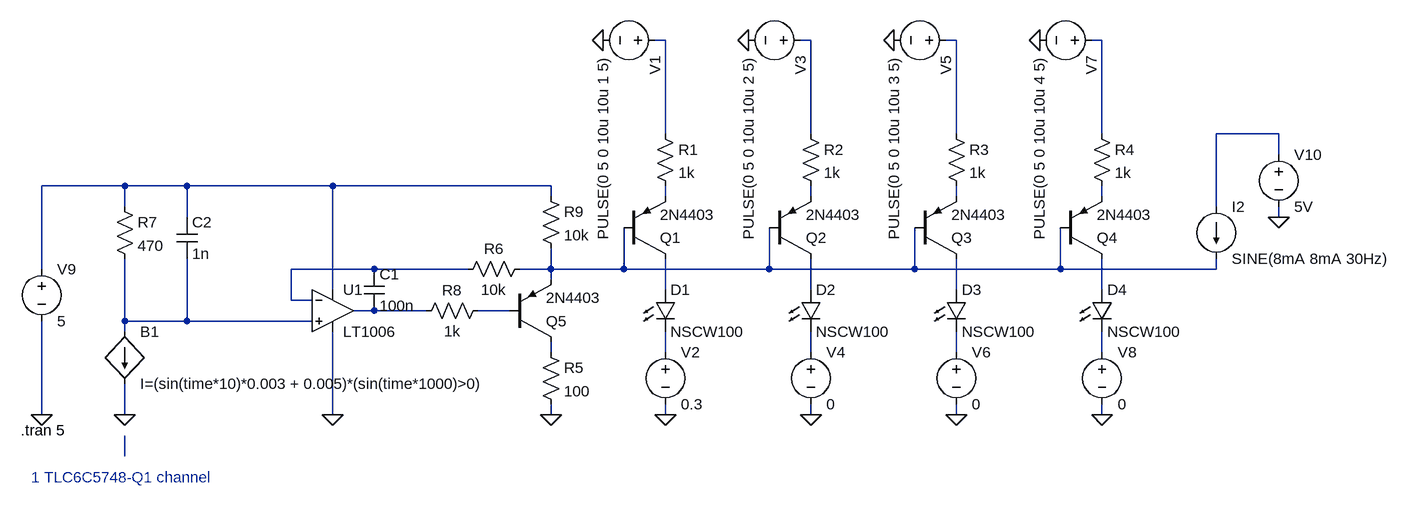
[diagram p0: schematic led-drive.asc]
led-drive.asc, the LTspice schematic file:
Version 4
SHEET 1 1884 680
WIRE 96 -496 80 -496
WIRE 320 -496 304 -496
WIRE 544 -496 528 -496
WIRE 768 -496 752 -496
WIRE 96 -352 96 -496
WIRE 320 -352 320 -496
WIRE 544 -352 544 -496
WIRE 768 -352 768 -496
WIRE 1040 -352 944 -352
WIRE 1040 -320 1040 -352
WIRE -736 -272 -864 -272
WIRE -640 -272 -736 -272
WIRE -416 -272 -640 -272
WIRE -80 -272 -416 -272
WIRE -80 -256 -80 -272
WIRE 96 -256 96 -272
WIRE 320 -256 320 -272
WIRE 544 -256 544 -272
WIRE 768 -256 768 -272
WIRE -736 -240 -736 -272
WIRE 944 -240 944 -352
WIRE -640 -224 -640 -272
WIRE 1040 -224 1040 -240
WIRE -864 -144 -864 -272
WIRE -352 -144 -480 -144
WIRE -208 -144 -352 -144
WIRE -80 -144 -80 -176
WIRE -80 -144 -128 -144
WIRE 32 -144 32 -208
WIRE 32 -144 -80 -144
WIRE 256 -144 256 -208
WIRE 256 -144 32 -144
WIRE 480 -144 480 -208
WIRE 480 -144 256 -144
WIRE 704 -144 704 -208
WIRE 704 -144 480 -144
WIRE 944 -144 944 -160
WIRE 944 -144 704 -144
WIRE -80 -128 -80 -144
WIRE -416 -112 -416 -272
WIRE 96 -112 96 -160
WIRE 320 -112 320 -160
WIRE 544 -112 544 -160
WIRE 768 -112 768 -160
WIRE -480 -96 -480 -144
WIRE -448 -96 -480 -96
WIRE -352 -80 -384 -80
WIRE -272 -80 -352 -80
WIRE -144 -80 -192 -80
WIRE -736 -64 -736 -160
WIRE -640 -64 -640 -160
WIRE -640 -64 -736 -64
WIRE -448 -64 -640 -64
WIRE -736 -48 -736 -64
WIRE -80 -16 -80 -32
WIRE 96 -16 96 -48
WIRE 320 -16 320 -48
WIRE 544 -16 544 -48
WIRE 768 -16 768 -48
WIRE -864 80 -864 -64
WIRE -736 80 -736 32
WIRE -416 80 -416 -48
WIRE -80 80 -80 64
WIRE 96 80 96 64
WIRE 320 80 320 64
WIRE 544 80 544 64
WIRE 768 80 768 64
WIRE -736 144 -736 112
FLAG 96 80 0
FLAG 0 -496 0
FLAG 320 80 0
FLAG 224 -496 0
FLAG 544 80 0
FLAG 448 -496 0
FLAG 768 80 0
FLAG 672 -496 0
FLAG -736 80 0
FLAG -864 80 0
FLAG 1040 -224 0
FLAG -416 80 0
FLAG -80 80 0
SYMBOL LED 80 -112 R0
SYMATTR InstName D1
SYMATTR Value NSCW100
SYMATTR Description Diode
SYMATTR Type diode
SYMBOL voltage 96 -496 R90
WINDOW 123 0 0 Left 2
WINDOW 39 0 0 Left 2
SYMATTR InstName V1
SYMATTR Value PULSE(0 5 0 10u 10u 1 5)
SYMBOL res 80 -368 R0
SYMATTR InstName R1
SYMATTR Value 1k
SYMBOL pnp 32 -160 M180
SYMATTR InstName Q1
SYMATTR Value 2N4403
SYMBOL voltage 96 -32 R0
WINDOW 123 0 0 Left 2
WINDOW 39 0 0 Left 2
SYMATTR InstName V2
SYMATTR Value 0.3
SYMBOL LED 304 -112 R0
SYMATTR InstName D2
SYMATTR Value NSCW100
SYMATTR Description Diode
SYMATTR Type diode
SYMBOL voltage 320 -496 R90
WINDOW 123 0 0 Left 2
WINDOW 39 0 0 Left 2
SYMATTR InstName V3
SYMATTR Value PULSE(0 5 0 10u 10u 2 5)
SYMBOL res 304 -368 R0
SYMATTR InstName R2
SYMATTR Value 1k
SYMBOL pnp 256 -160 M180
SYMATTR InstName Q2
SYMATTR Value 2N4403
SYMBOL voltage 320 -32 R0
WINDOW 123 0 0 Left 2
WINDOW 39 0 0 Left 2
SYMATTR InstName V4
SYMATTR Value 0
SYMBOL LED 528 -112 R0
SYMATTR InstName D3
SYMATTR Value NSCW100
SYMATTR Description Diode
SYMATTR Type diode
SYMBOL voltage 544 -496 R90
WINDOW 123 0 0 Left 2
WINDOW 39 0 0 Left 2
SYMATTR InstName V5
SYMATTR Value PULSE(0 5 0 10u 10u 3 5)
SYMBOL res 528 -368 R0
SYMATTR InstName R3
SYMATTR Value 1k
SYMBOL pnp 480 -160 M180
SYMATTR InstName Q3
SYMATTR Value 2N4403
SYMBOL voltage 544 -32 R0
WINDOW 123 0 0 Left 2
WINDOW 39 0 0 Left 2
SYMATTR InstName V6
SYMATTR Value 0
SYMBOL LED 752 -112 R0
SYMATTR InstName D4
SYMATTR Value NSCW100
SYMATTR Description Diode
SYMATTR Type diode
SYMBOL voltage 768 -496 R90
WINDOW 123 0 0 Left 2
WINDOW 39 0 0 Left 2
SYMATTR InstName V7
SYMATTR Value PULSE(0 5 0 10u 10u 4 5)
SYMBOL res 752 -368 R0
SYMATTR InstName R4
SYMATTR Value 1k
SYMBOL pnp 704 -160 M180
SYMATTR InstName Q4
SYMATTR Value 2N4403
SYMBOL voltage 768 -32 R0
WINDOW 123 0 0 Left 2
WINDOW 39 0 0 Left 2
SYMATTR InstName V8
SYMATTR Value 0
SYMBOL res -752 -256 R0
SYMATTR InstName R7
SYMATTR Value 470
SYMBOL voltage -864 -160 R0
WINDOW 123 0 0 Left 2
WINDOW 39 0 0 Left 2
SYMATTR InstName V9
SYMATTR Value 5
SYMBOL current 944 -240 R0
WINDOW 123 0 0 Left 2
WINDOW 39 0 0 Left 2
SYMATTR InstName I2
SYMATTR Value SINE(8mA 8mA 30Hz)
SYMBOL voltage 1040 -336 R0
WINDOW 123 0 0 Left 2
WINDOW 39 0 0 Left 2
SYMATTR InstName V10
SYMATTR Value 5V
SYMBOL Opamps\\LT1006 -416 -144 R0
SYMATTR InstName U1
SYMBOL pnp -144 -32 M180
SYMATTR InstName Q5
SYMATTR Value 2N4403
SYMBOL res -96 -32 R0
SYMATTR InstName R5
SYMATTR Value 100
SYMBOL cap -368 -144 R0
SYMATTR InstName C1
SYMATTR Value 100n
SYMBOL res -112 -160 R90
WINDOW 0 0 56 VBottom 2
WINDOW 3 32 56 VTop 2
SYMATTR InstName R6
SYMATTR Value 10k
SYMBOL bi -736 -48 R0
SYMATTR InstName B1
SYMATTR Value I=(sin(time*10)*0.003 + 0.005)*(sin(time*1000)>0)
SYMBOL res -176 -96 R90
WINDOW 0 0 56 VBottom 2
WINDOW 3 32 56 VTop 2
SYMATTR InstName R8
SYMATTR Value 1k
SYMBOL cap -656 -224 R0
SYMATTR InstName C2
SYMATTR Value 1n
SYMBOL res -96 -272 R0
SYMATTR InstName R9
SYMATTR Value 10k
TEXT -896 104 Left 2 !.tran 5
TEXT -880 176 Left 2 ;1 TLC6C5748-Q1 channel

The netlist it stands for:
* led-drive.asc
D1 N013 N021 NSCW100
V1 N001 0 PULSE(0 5 0 10u 10u 1 5)
R1 N001 N007 1k
Q1 N013 N012 N007 0 2N4403
V2 N021 0 0.3
D2 N014 N022 NSCW100
V3 N002 0 PULSE(0 5 0 10u 10u 2 5)
R2 N002 N008 1k
Q2 N014 N012 N008 0 2N4403
V4 N022 0 0
D3 N015 N023 NSCW100
V5 N003 0 PULSE(0 5 0 10u 10u 3 5)
R3 N003 N009 1k
Q3 N015 N012 N009 0 2N4403
V6 N023 0 0
D4 N016 N024 NSCW100
V7 N004 0 PULSE(0 5 0 10u 10u 4 5)
R4 N004 N010 1k
Q4 N016 N012 N010 0 2N4403
V8 N024 0 0
R7 N006 N019 470
V9 N006 0 5
I2 N005 N012 SINE(8mA 8mA 30Hz)
V10 N005 0 5V
XU1 N019 N011 N006 0 N017 LT1006  ; pins In+ In- V+ V- OUT
Q5 N020 N018 N012 0 2N4403
R5 N020 0 100
C1 N011 N017 100n
R6 N012 N011 10k
B1 N019 0 I=(sin(time*10)*0.003 + 0.005)*(sin(time*1000)>0)
R8 N018 N017 1k
C2 N006 N019 1n
R9 N006 N012 10k
.model D D
.lib standard.dio
.model NPN NPN
.model PNP PNP
.lib standard.bjt
.tran 5
* 1 TLC6C5748-Q1 channel
.lib LTC.lib
.backanno
.end